# Altium schematic sheet V_AUX.SchDoc
size A4; SheetNumber: 6; SheetTotal: 8
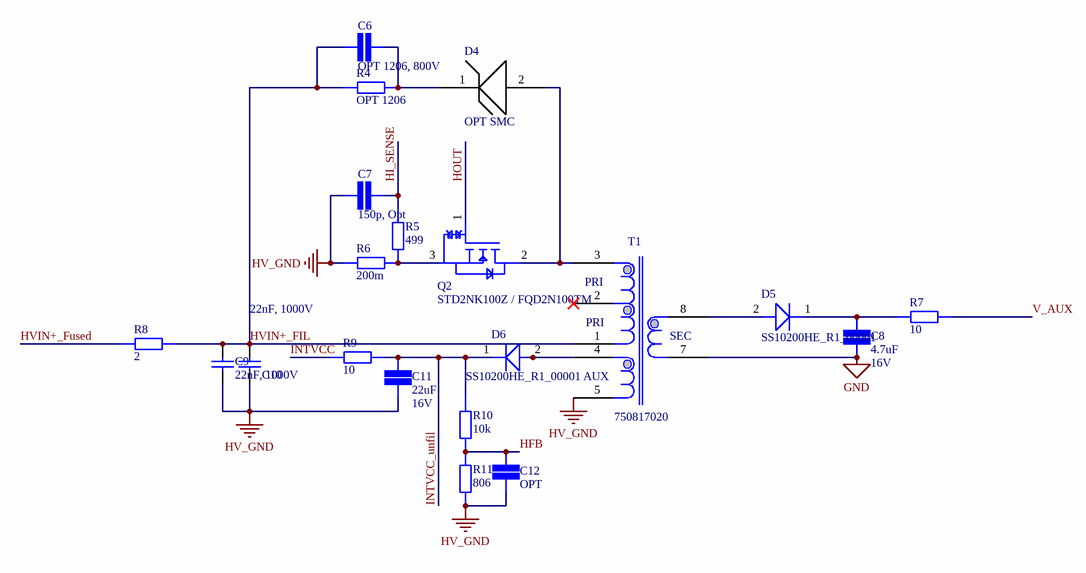
[diagram p0: V_AUX.SchDoc]

## Parts
C6  value OPT 1206, 800V  [CAP 1206/3216]  (hidden comment: SMD Capacitor)
C7  value 150p, Opt  [CAP 0603/1608]  (hidden comment: SMD Capacitor)
C8  value 4.7uF  Voltage: 16V  [CAP 0603/1608]  (hidden comment: SMD Capacitor)
C9  22nF, 1000V  [WCAP-CSMH_1210_H1.6]
C10  22nF, 1000V  [WCAP-CSMH_1210_H1.6]
C11  value 22uF  Voltage: 16V  [CAP 0603/1608]  (hidden comment: SMD Capacitor)
C12  value OPT  [CAP 0603/1608]  (hidden comment: SMD Capacitor)
D4  OPT SMC  [JEDEC DO-214AB]
D5  SS10200HE_R1_00001  [Chip2PinSM127P600-8N]
D6  SS10200HE_R1_00001  [Chip2PinSM127P600-8N]
Q2  STD2NK100Z / FQD2N100TM  [DPAK TO-252]
R4  value OPT 1206  [STACKPOLE CSR1206]  (hidden comment: SMD Resistor)
R5  value 499  [STACKPOLE CSR0603]  (hidden comment: SMD Resistor)
R6  value 200m  [STACKPOLE CSR0603]  (hidden comment: KDV12FR200ET)
R7  value 10  [STACKPOLE CSR0603]  (hidden comment: SMD Resistor)
R8  value 2  [STACKPOLE CSR0603]  (hidden comment: SMD Resistor)
R9  value 10  [STACKPOLE CSR0603]  (hidden comment: SMD Resistor)
R10  value 10k  [STACKPOLE CSR0603]  (hidden comment: SMD Resistor)
R11  value 806  [STACKPOLE CSR0603]  (hidden comment: SMD Resistor)
T1  750817020  [750817020 Transformer]

## Nets
GND: C8.1 T1.7
HV_GND: C7.1 C9.1 C10.1 C11.1 C12.2 R6.2 R11.2 T1.5
HFB: C12.1 R10.2 R11.1
HI_SENSE: C7.2 R5.1
HOUT: Q2.1
HVIN+_FIL: C6.1 C9.2 C10.2 R4.1 R8.1 T1.1
HVIN+_Fused: R8.2
INTVCC: R9.2
INTVCC_unfil: C11.2 D6.1 R9.1 R10.1
V_AUX: R7.1
NetC6_2: C6.2 D4.1 R4.2
NetC8_2: C8.2 D5.1 R7.2
NetD4_2: D4.2 Q2.2 T1.3
NetD5_2: D5.2 T1.8
NetD6_2: D6.2 T1.4
NetQ2_3: Q2.3 R5.2 R6.1

Not connected (* = marked no-connect by the designer): T1 2*

## Notes on the sheet
- Title:
- Projekt:
- Revision:
- Author:
- Rules:
- Checked by:
- Sheet
- of
- Size:
- A4
- Date:
- Time:
- (in symbol 750817020) PRI; SEC; AUX

## Library data of the parts
C6-C8 C11 C12 = SMD Capacitor: Capacitor with multiple Footprints
C9 C10 = 885342209007: WCAP-CSMH Multilayer Ceramic Chip Capacitor, size 1210, X7R Class II, 22nF, 1000V; Manufacturer: Wurth Elektronik; Rated Voltage: 1000VDC; Insulation Resistance: 4.55GOhm; Dissipation Factor: 2.5%; Capacitance Tolerance: +/-10%; Technical Reference: X7R1210223KA00DFCT10000; ComponentLink1Description: Manufacturer; ComponentLink1URL: http://www.we-online.de; ComponentLink2Description: Datasheet; ComponentLink2URL: https://www.we-online.com/catalog/datasheet/885342209007.pdf; Manufacturer Part Number: 885342209007; Mounting Technology: SMT; Operating Temperature: -55 to +125degC; Published Date: May 2020; Packaging: Tape and Reel; Ceramic Type: X7R Class II; Capacitance: 22nF; Height: 1.6mm; Size: 1210
D4 = SMC30J24A: Manufacturer: STMicroelectronics; Direction: Unidirectional; Number of Unidirectional Channels: 1; Reverse Standoff Voltage: 24V; Min Breakdown Voltage: 26.7V; Clamping Voltage: 38.9V; Peak Pulse Power: 3kW; Power Line Protection: No; Peak Pulse Current: 77A; Diode Type: ZENER; Supplier 1: Newark; Manufacturer Part Number: SMC30J24A; RoHS: Yes; Category: Diodes; Pricing 1: 2500=0,61100 (USD); Mount: Surface Mount; Case/Package: SMC; Number of Pins: 2; Min Operating Temperature: -55°C; Max Operating Temperature: 175°C; Packaging: Tape and Reel; Package Quantity: 2500; Polarity: Unidirectional; Working Voltage: 24V; Max Power Dissipation: 3kW; Breakdown Voltage: 26.7V; Resistor Type: Zener; Series: SMC30J, TRANSIL™; Radiation Hardening: No; REACH SVHC: No SVHC; Lead Free: Lead Free; RoHS Compliant: Yes; ComponentLink1URL: https://datasheet.ciiva.com/339/dm00035134-339433.pdf?src-supplier=Digi-Key; ComponentLink1Description: https://datasheet.ciiva.com/339/dm00035134-339433.pdf?src-supplier=Digi-Key; ComponentLink2URL: https://datasheet.ciiva.com/339/dm00035134-339434.pdf?src-supplier=Digi-Key; ComponentLink2Description: https://datasheet.ciiva.com/339/dm00035134-339434.pdf?src-supplier=Digi-Key; ComponentLink3URL: https://datasheet.ciiva.com/339/dm00035134-339435.pdf?src-supplier=Digi-Key; ComponentLink3Description: https://datasheet.ciiva.com/339/dm00035134-339435.pdf?src-supplier=Digi-Key; Supplier Part Number 1: 87T3691
D5 D6 = SS10200HE_R1_00001: Schottky 1A 200V SOD-123HE; Manufacturer: Pan Jit; Supplier 1: DigiKey; Manufacturer Part Number: SS10200HE_R1_00001; RoHS: Yes; Stock 1: 9000; Pricing 1: 1=0,40000, 10=0,30100, 100=0,17040, 500=0,11286, 1000=0,08653 (USD)
Q2 = STD2NK100Z: N-channel 1000 V, 6.25 Ohm typ., 1.85 A, Zener-protected SuperMESH Power MOSFET in DPAK package; Manufacturer: STMicroelectronics; Continuous Drain Current (ID): 1.85A; Gate to Source Voltage (Vgs): 30V; Rds On Max: 8.5R; Input Capacitance: 499pF; Max Power Dissipation: 70W; Number of Elements: 1; Drain to Source Voltage (Vdss): 1kV; Threshold Voltage: 3.75V; Turn-On Delay Time: 7.2ns; Turn-Off Delay Time: 41.5ns; Element Configuration: Single; Supplier 1: Digi-Key; Manufacturer Part Number: STD2NK100Z; RoHS: Yes; Category: MOSFETs; Stock 1: 2365; Pricing 1: 1=2,45000, 10=2,19600, 100=1,76550, 500=1,45048, 1000=1,31862 (USD); Mount: Surface Mount; Case/Package: DPAK; Number of Pins: 3; Contact Plating: Tin,Matte; Min Operating Temperature: -55°C; Max Operating Temperature: 150°C; Packaging: Tape and Reel; Package Quantity: 2500; Drain to Source Breakdown Voltage: 1kV; Drain to Source Resistance: 8.5R; Power Dissipation: 70W; On-State Resistance: 8.5R; Polarity: N-CHANNEL; Series: SuperMESH™; Drain-source On Resistance-Max: 8.5R; Length: 6.6mm; Width: 6.2mm; Height: 2.4mm; Radiation Hardening: No; REACH SVHC: No SVHC; Lead Free: Lead Free; RoHS Compliant: Yes; ComponentLink1URL: https://datasheet.ciiva.com/8025/1561863-8025045.pdf?src-supplier=Element14; ComponentLink1Description: https://datasheet.ciiva.com/8025/1561863-8025045.pdf?src-supplier=Element14; ComponentLink2URL: https://datasheet.ciiva.com/25625/0900766b810e895b-25625259.pdf?src-supplier=RSComponents; ComponentLink2Description: https://datasheet.ciiva.com/25625/0900766b810e895b-25625259.pdf?src-supplier=RSComponents; ComponentLink3URL: https://datasheet.ciiva.com/938/cd00159991-938647.pdf?src-supplier=Digi-Key; ComponentLink3Description: https://datasheet.ciiva.com/938/cd00159991-938647.pdf?src-supplier=Digi-Key; ComponentLink4URL: https://datasheet.ciiva.com/6380/cd00159991-6380217.pdf?src-supplier=Digi-Key; ComponentLink4Description: https://datasheet.ciiva.com/6380/cd00159991-6380217.pdf?src-supplier=Digi-Key; ComponentLink5URL: https://datasheet.ciiva.com/16220/cd00159991-16220233.pdf?src-supplier=Future+Electronics; ComponentLink5Description: https://datasheet.ciiva.com/16220/cd00159991-16220233.pdf?src-supplier=Future+Electronics; ComponentLink6URL: https://datasheet.ciiva.com/6380/cd00159991-6380219.pdf?src-supplier=Digi-Key; ComponentLink6Description: https://datasheet.ciiva.com/6380/cd00159991-6380219.pdf?src-supplier=Digi-Key
R4-R11 = SMD Resistor: Resistor with multiple footprints
T1 = 750817020: WE Transformer